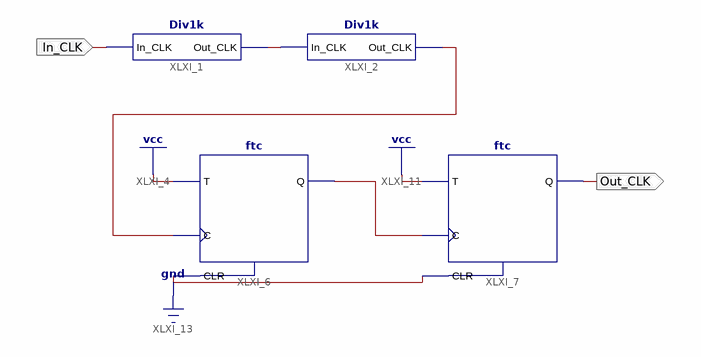
[diagram p0: schematic sheet 1]
// Xilinx ISE schematic Div4M.sch (spartan6) as structural Verilog: 4 symbols, 2 ports
module Div4M (
  input  In_CLK,
  output Out_CLK
);

  wire XLXN_1, XLXN_21, XLXN_22;

  Div1k XLXI_1 (.In_CLK(In_CLK), .Out_CLK(XLXN_1));
  Div1k XLXI_2 (.In_CLK(XLXN_1), .Out_CLK(XLXN_22));
  ftc XLXI_6 (.C(XLXN_22), .CLR(1'b0), .T(1'b1), .Q(XLXN_21));
  ftc XLXI_7 (.C(XLXN_21), .CLR(1'b0), .T(1'b1), .Q(Out_CLK));
endmodule
